# Altium schematic sheet Sheet1.SchDoc
size A4
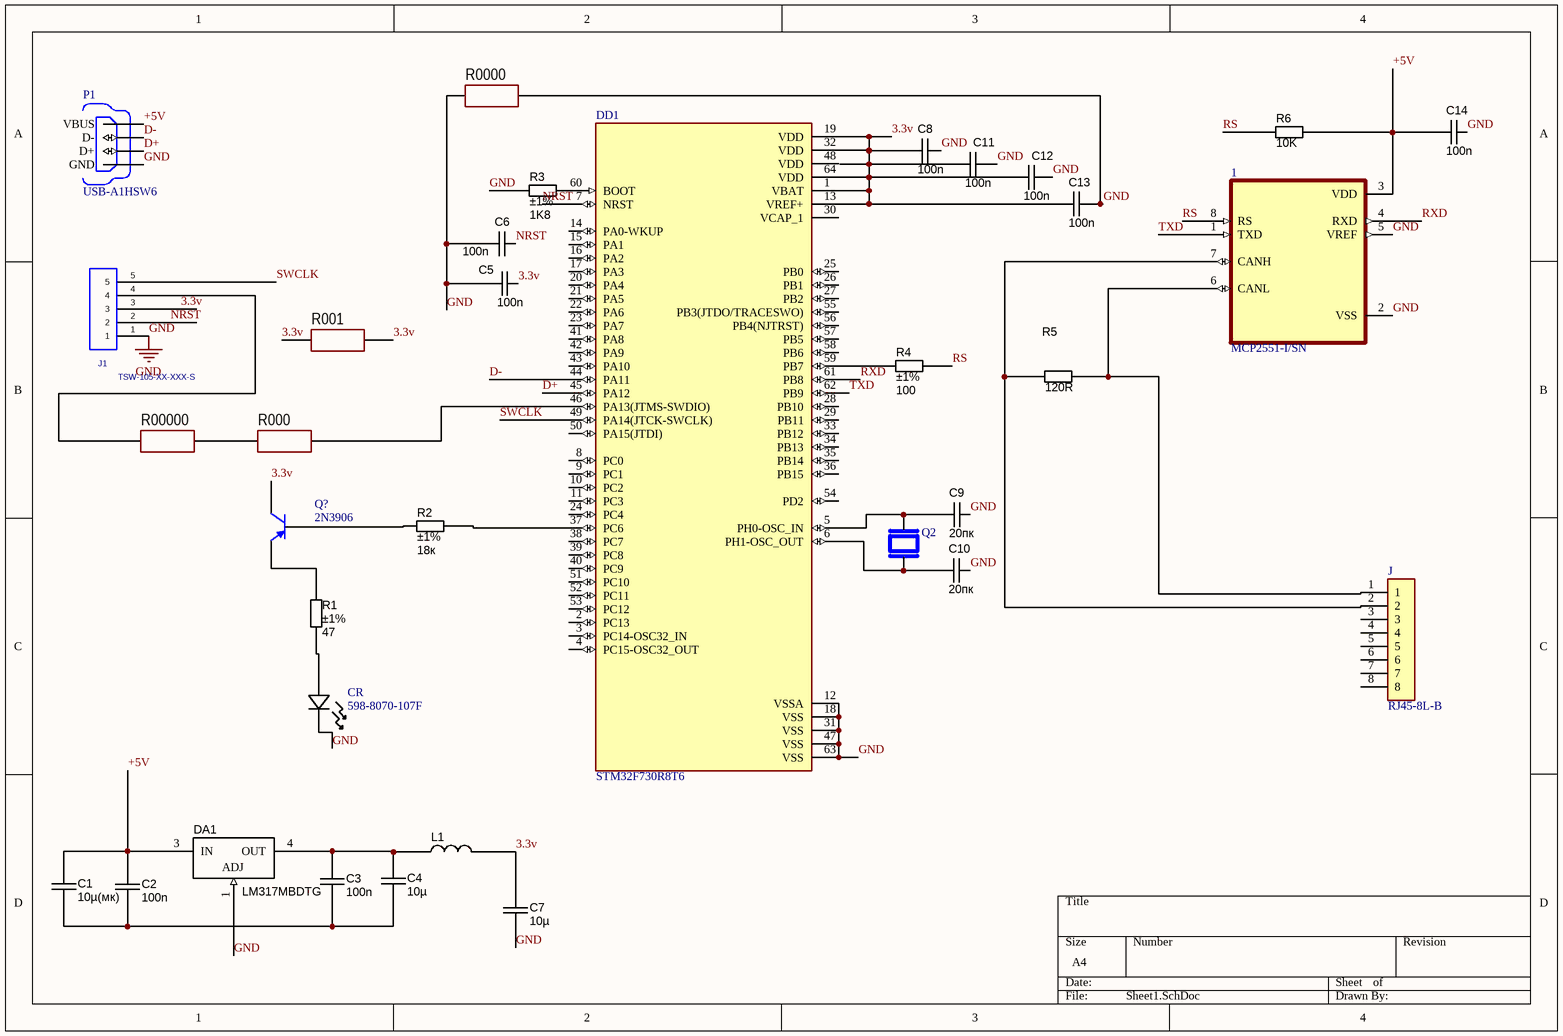
[diagram p0: Sheet1.SchDoc]

## Parts
1  MCP2551-I/SN  [SOIC127P599X175-8N]
C1  10µ(мк)  [CAPC3225X220N]
C2  value 100n  [CAPC1608X90N]  (hidden comment: approved sub OK)
C3  value 100n  [CAPC1608X90N]  (hidden comment: approved sub OK)
C4  10µ  [CAPC3225X220N]
C5  value 100n  [CAPC1608X90N]  (hidden comment: approved sub OK)
C6  value 100n  [CAPC1608X90N]  (hidden comment: approved sub OK)
C7  10µ  [CAPC3225X220N]
C8  value 100n  [CAPC1608X90N]  (hidden comment: approved sub OK)
C9  20пк  [CAPC1608X90N]
C10  20пк  [CAPC1608X90N]
C11  value 100n  [CAPC1608X90N]  (hidden comment: approved sub OK)
C12  value 100n  [CAPC1608X90N]  (hidden comment: approved sub OK)
C13  value 100n  [CAPC1608X90N]  (hidden comment: approved sub OK)
C14  value 100n  [CAPC1608X90N]  (hidden comment: approved sub OK)
CR  598-8070-107F  [LED_DIALIGHT_598_DIA]
DA1  Adjustable  [TO-252]  (value not drawn)
DD1  STM32F730R8T6  [QFP50P1200X1200X160-64N]
J  RJ45-8L-B  [TE_RJ45-8L-B]
J1  TSW-105-XX-XXX-S  [TSW-105-XX-XXX-S]
L1  (no value)  [FBC2012N]
P1  USB-A1HSW6  [OST_USB-A1HSW6]
Q2  D  [OSC_XRCHA16M000F0A01R0]  (value not drawn)
Q?  2N3906  [TO-92A]
R0000  (no value)  [RES: 0805]
R00000  (no value)  [RES: 0805]
R000  (no value)  [RES: 0805]
R1  value 47  Tolerance: ±1%  [RESC2012X70N]  (hidden comment: Thick Film)
R001  (no value)  [RES: 0805]
R2  value 18к  Tolerance: ±1%  [RESC2012X70N]  (hidden comment: Thick Film)
R3  value 1K8  Tolerance: ±1%  [RESC2012X70N]  (hidden comment: Thick Film)
R4  value 100  Tolerance: ±1%  [RESC2012X70N]  (hidden comment: Thick Film)
R5  value 120R  [RESC2012X70N]  (hidden comment: Thick Film)
R6  value 10K  [RESC2012X70N]  (hidden comment: Thick Film)

## Nets
GND: 1.2(VSS) 1.5(VREF) C5.1 C6.1 C7.2 C8.2 C9.2 C10.2 C11.2 C12.2 C13.2 C14.2 CR.1 DA1.1(ADJ) DD1.12(VSSA) DD1.18(VSS) DD1.31(VSS) DD1.47(VSS) DD1.63(VSS) J1.1 P1.4(GND) R0000.1 R0000.2 R3.1
3.3v: C5.2 C7.1 C8.1 C11.1 C12.1 C13.1 DD1.1(VBAT) DD1.13(VREF+) DD1.19(VDD) DD1.32(VDD) DD1.64(VDD) J1.3 L1.2 Q?.3(C) R001.1 R001.2
+5V: 1.3(VDD) C1.1 C2.1 C14.1 DA1.3(IN) P1.1(VBUS) R6.2
D+: DD1.45(PA12) P1.3(D+)
D-: DD1.44(PA11) P1.2(D-)
NRST: C6.2 DD1.7(NRST) J1.2
RS: 1.8(RS) R4.2 R6.1
RXD: 1.4(RXD) DD1.61(PB8)
SWCLK: DD1.49(PA14(JTCK-SWCLK)) J1.5
TXD: 1.1(TXD) DD1.62(PB9)
Net1_6: 1.6(CANL) J.1 R5.2
Net1_7: 1.7(CANH) J.2 R5.1
NetC1_2: C1.2 C2.2 C3.2 C4.2
NetC3_1: C3.1 C4.1 DA1.4(OUT) L1.1
NetC9_1: C9.1 DD1.5(PH0-OSC_IN) Q2.2
NetC10_1: C10.1 DD1.6(PH1-OSC_OUT) Q2.1
NetCR_2: CR.2 R1.2
NetDD1_37: DD1.37(PC6) R2.2
NetDD1_46: DD1.46(PA13(JTMS-SWDIO)) R000.2
NetDD1_59: DD1.59(PB7) R4.1
NetDD1_60: DD1.60(BOOT) R3.2
NetJ1_4: J1.4 R00000.1
NetQ?_1: Q?.1(E) R1.1
NetQ?_2: Q?.2(B) R2.1
NetR000_1: R000.1 R00000.2

Not connected (* = marked no-connect by the designer): DD1 2(PC13) 3(PC14-OSC32_IN) 4(PC15-OSC32_OUT) 8(PC0) 9(PC1) 10(PC2) 11(PC3) 14(PA0-WKUP) 15(PA1) 16(PA2) 17(PA3) 20(PA4) 21(PA5) 22(PA6) 23(PA7) 24(PC4) 25(PB0) 26(PB1) 27(PB2) 28(PB10) 29(PB11) 30(VCAP_1) 33(PB12) 34(PB13) 35(PB14) 36(PB15) 38(PC7) 39(PC8) 40(PC9) 41(PA8) 42(PA9) 43(PA10) 48(VDD) 50(PA15(JTDI)) 51(PC10) 52(PC11) 53(PC12) 54(PD2) 55(PB3(JTDO/TRACESWO)) 56(PB4(NJTRST)) 57(PB5) 58(PB6); J 3 4 5 6 7 8

## Library data of the parts
1 = MCP2551-I/SN: 1/1 Transceiver Half CANbus 8-SOIC; MF: Microchip; Price: None; SnapEDA_Link: https://www.snapeda.com/parts/MCP2551-I/SN/Microchip/view-part/10929/?ref=snap; MP: MCP2551-I/SN; Value: *; Availability: Unavailable; Package: SOIC-8 Microchip
C1 C4 C7 = CAPC_10u_1210_50V: Capacitor SMD Cer 10uF 20% 16V X5R 1210; Manufacturer 1: Taiyo Yuden; Manufacturer Part Number 1: UMK325BJ106MM-T; Ratings: 50V; X5R; Material: ceramic; SCDType: spec; Package / Case: 1210 (3225 Metric); Tolerance: ±20%; Size / Dimension: 0.126" L x 0.098" W (3.20mm x 2.50mm); Supplier 1: Digi-Key; Supplier Part Number 1: 587-2225-1-ND
  C1: Value: 10µ(мк)
  C4 C7: Value: 10µ
C2 C3 C5 C6 C8 C11-C14 = CAPC_100n_0603_X7R_50V_10%: Capacitor SMD Cer 100nF 10% 50V X7R 0603; Manufacturer 1: AVX Corporation; Manufacturer Part Number 1: 06035C104KAT2A; Ratings: 50V; X7R; Material: ceramic; SCDType: spec; Manufacturer 2: TDK Corporation; Manufacturer Part Number 2: C1608X7R1H104K; Package / Case: 0603 (1608 Metric); Tolerance: ±10%; Supplier 1: Digi-Key; Supplier Part Number 1: 478-5052-1-ND; ComponentLink1URL: http://www.avx.com/docs/Catalogs/cx7r.pdf; ComponentLink1Description: http://www.avx.com/docs/Catalogs/cx7r.pdf; Supplier 2: Digi-Key; Supplier Part Number 2: 445-1314-1-ND; ComponentLink2URL: http://product.tdk.com/capacitor/mlcc/en/documents/mlcc_commercial_general_en.pdf; ComponentLink2Description: http://product.tdk.com/capacitor/mlcc/en/documents/mlcc_commercial_general_en.pdf
C9 C10 = CAPC_18p_0603_100V: Capacitor SMD Cer 18pF 2% 100V NP0 0603; Manufacturer 1: AVX Corporation; Manufacturer Part Number 1: 06031A180GAT2A; Ratings: 100V; NP0; SCDType: spec; Tolerance: ±2%; Operating Temperature: -55°C ~ 125°C; Package / Case: 0603 (1608 Metric); Supplier 1: Digi-Key; Supplier Part Number 1: 478-6025-1-ND; Size / Dimension: 0.063" L x 0.032" W (1.60mm x 0.81mm); Thickness (Max): 0.035" (0.90mm); ComponentLink1URL: http://www.avx.com/docs/Catalogs/ccog.pdf; ComponentLink1Description: http://www.avx.com/docs/Catalogs/ccog.pdf; Value: 20пк
CR = 598-8070-107F: No Description Available; Vendor: Dialight; Built_By: EMA_UL_Team; SourceLibrary: Dialight_2012-01-01_LED_598; Manufacturer_Part_Number: 598-8070-107F; Copyright: Copyright (C) 2021 Accelerated Designs. All rights reserved; RefDes: RefDes; Type: DEV
DA1 = LM317MBDTG: Voltage Regulator IC, DPAK SMD, LM317MBDTG; Manufacturer 1: ON Semiconductor; Voltage Regulator Type: Adjustable Positive Linear; Tolerance: 0.04%; Ratings: 40V in-out; 500mA; Value: variable; SCDType: spec\; Package / Case: DPAK/TO-252; Supplier 1: Digi-Key; Supplier Part Number 1: LM317MBDTGOS-ND; Manufacturer Part Number 1: LM317MBDTG
DD1 = STM32F730R8T6: ARMÂ® CortexÂ®-M7 STM32F7 Microcontroller IC 32-Bit 216MHz 64KB (64K x 8) FLASH 64-LQFP (10x10); MF: STMicroelectronics; Availability: Good; Check_prices: https://www.snapeda.com/parts/STM32F730R8T6/STMicroelectronics/view-part/3192404/?ref=eda; SnapEDA_Link: https://www.snapeda.com/parts/STM32F730R8T6/STMicroelectronics/view-part/3192404/?ref=snap; Price: None; MP: STM32F730R8T6; Value: *; Purchase-URL: https://pricing.snapeda.com/search/part/STM32F730R8T6/?ref=eda; Package: LQFP-64 STMicroelectronics
J = RJ45-8L-B: Jack Modular Connector 8p8c _RJ45, Ethernet_ 90Â° Angle _Right_ Unshielded; MF: TE Connectivity; MP: RJ45-8L-B; Package: None; Price: None; Availability: Unavailable; TE_purchase_URL: https://www.te.com/usa-en/product-RJ45-8L-B.html?te_bu=Cor&te_type=disp&te_campaign=seda_glo_cor-seda-global-disp-prtnr-fy19-seda-model-bom-cta_sma-317_1&elqCampaignId=32493; Value: *; SnapEDA_Link: https://www.snapeda.com/parts/RJ45-8L-B/TE%20Connectivity%20Corcom%20Filters/view-part/423036/?ref=snap
J1 = TSW-105-XX-XXX-S: SINGLE ROW .025[0.64] SQ. POST TERMINAL STRIP ASSEMBLY,; MANUFACTURER: SAMTEC; CREATED BY: July 28, 2014 - Wendy Xin; PCB DECAL: TSW-105-XX-XXX-S
L1 = FERRITE_2K2-100MHz_0805: Ferrite bead 2.2K Ohm at 100 MHz 200mA 0805 SMD; Manufacturer 1: Laird-Signal Integrity Products; Ratings: 200 mA; 800 mOhm DC; Impedance @ Frequency: 600 Ohm @ 100MHz; DC Resistance (DCR): 800 mOhm Max; Filter Type: Differential Mode - Single; SCDType: source; Size / Dimension: 0.063" L x 0.031" W (1.60mm x 0.80mm); Current Rating: 200mA; Package / Case: 0805 (2012 Metric); Height (Max): 0.043" (1.09mm); ComponentLink1URL: http://www.lairdtech.com/WorkArea/linkit.aspx?LinkIdentifier=id&ItemID=4879; ComponentLink1Description: http://www.lairdtech.com/WorkArea/linkit.aspx?LinkIdentifier=id&ItemID=4879; Supplier 1: Digi-Key; Supplier Part Number 1: 240-2562-1-ND; Mounting Type: Surface Mount
P1 = USB-A1HSW6: USB-A _USB TYPE-A_  Receptacle Connector 4 Position Through Hole, Right Angle; MF: On Shore; SnapEDA_Link: https://www.snapeda.com/parts/USB-A1HSW6/On%20Shore%20Technology%20Inc./view-part/13110/?ref=snap; Package: None; MP: USB-A1HSW6; Availability: Unavailable; Price: None; Value: *
Q2 = XRCHA16M000F0A01R0: 16MHz Â±100ppm Crystal 8pF 100 Ohms 2-SMD, No Lead; MF: Murata; DigiKey-Purchase-URL: https://snapeda.com/shop?store=DigiKey&id=4970146; MP: XRCHA16M000F0A01R0; SnapEDA_Link: https://www.snapeda.com/parts/XRCHA16M000F0A01R0/Murata/view-part/4970146/?ref=snap; Arrow_Electronics-Purchase-URL: https://snapeda.com/shop?store=Arrow+Electronics&id=4970146; Availability: Good; Mouser-Purchase-URL: https://snapeda.com/shop?store=Mouser&id=4970146; Package: SMD-2 Murata; Value: *; Price: None
Q? = 2N3906: PNP General Purpose Amplifier; Published: 8-Jun-2000; LatestRevisionDate: 15-Jan-2003; LatestRevisionNote: PCB Footprint 'BCY-W3/D4.7' replaced; DatasheetVersion: 1997; PackageVersion: Sep-1998; PackageReference: TO-92A; Publisher: Altium Limited; PackageDescription: TO, Flat Index; 3 In-Line, Axial Leads; Body Dia. 4.5mm; Leads 0.51 x 0.48 mm (max); ComponentLink1Description: Manufacturer Link; ComponentLink1URL: http://www.fairchildsemi.com/; ComponentLink2Description: Datasheet; ComponentLink2URL: http://www.fairchildsemi.com/ds/2N%2F2N3906.pdf
R0000 R00000 R000 R001 = Resistor_0805: Manufacturer: Yageo; PartNumber: RC0805JR-07100RL; TypeResistor: Resistor film; Power: 0.125W; Tolerance: ±5%; Package: 0805; HelpURL: https://www.digikey.com/product-detail/en/yageo/RC0805JR-07100RL/311-100ARCT-ND/731185; ValueManufacturerPartNumber: =TypeResistor+', '+Value+', '+Tolerance+', '+Package+', '+Power+', '+Temperature; Temperature: -55...+125°C
R1-R3 = RES_1K8_0805_1%: Resistor SMD chip 1.8k Ohm 0.125W 1% 0805; Manufacturer 1: Vishay/Dale; Manufacturer Part Number 1: CRCW08051K80FKEA; Ratings: 1/8W; SCDType: spec; Package / Case: 0805 (2012 metric); Supplier 1: Digi-Key; Supplier Part Number 1: 541-1.80KCCT-ND
R4 = RES_100R_0805_1%: Resistor SMD chip 100 Ohm 0.125W 1% 0805; Manufacturer 1: Yageo; Manufacturer Part Number 1: RC0805FR-07100RL; Ratings: 1/8 W; SCDType: spec; Package / Case: 0805 (2012 Metric); Material: Thick Film; Supplier 1: Digi-Key; Supplier Part Number 1: 311-100CRCT-ND
R5 = RES_150R_0805_5%: Resistor SMD chip 150 Ohm 0.125W 5% 0805; Manufacturer 1: Vishay/Dale; Manufacturer Part Number 1: CRCW0805150RJNEA; Ratings: 1/8W; SCDType: spec; Tolerance: ±5%; Package / Case: 0805 (2012 metric); Supplier 1: Digi-Key; Supplier Part Number 1: 541-150ACT-ND
R6 = RES_10K_0805_5%: Resistor SMD chip 10k Ohm 0.125W 5% 0805; Manufacturer 1: Yageo; Manufacturer Part Number 1: RC0805JR-0710KL; Ratings: 1/8 W; SCDType: spec; Package / Case: 0805 (2012 metric); Tolerance: ±5%; Material: Thick Film; Supplier 1: Digi-Key; Supplier Part Number 1: 311-10KARCT-ND